# EasyEDA schematic 1-Schematic_polaris_3.3 copy.json

## Sheets
1 S_3.3_1.2 copy: TITLE: TESTING BY ACUI; REV: 3.3; Date: 2021-12-22; Sheet: 1/2; Drawn By: Syahmi Fouzi; Company: Hermit Solutions
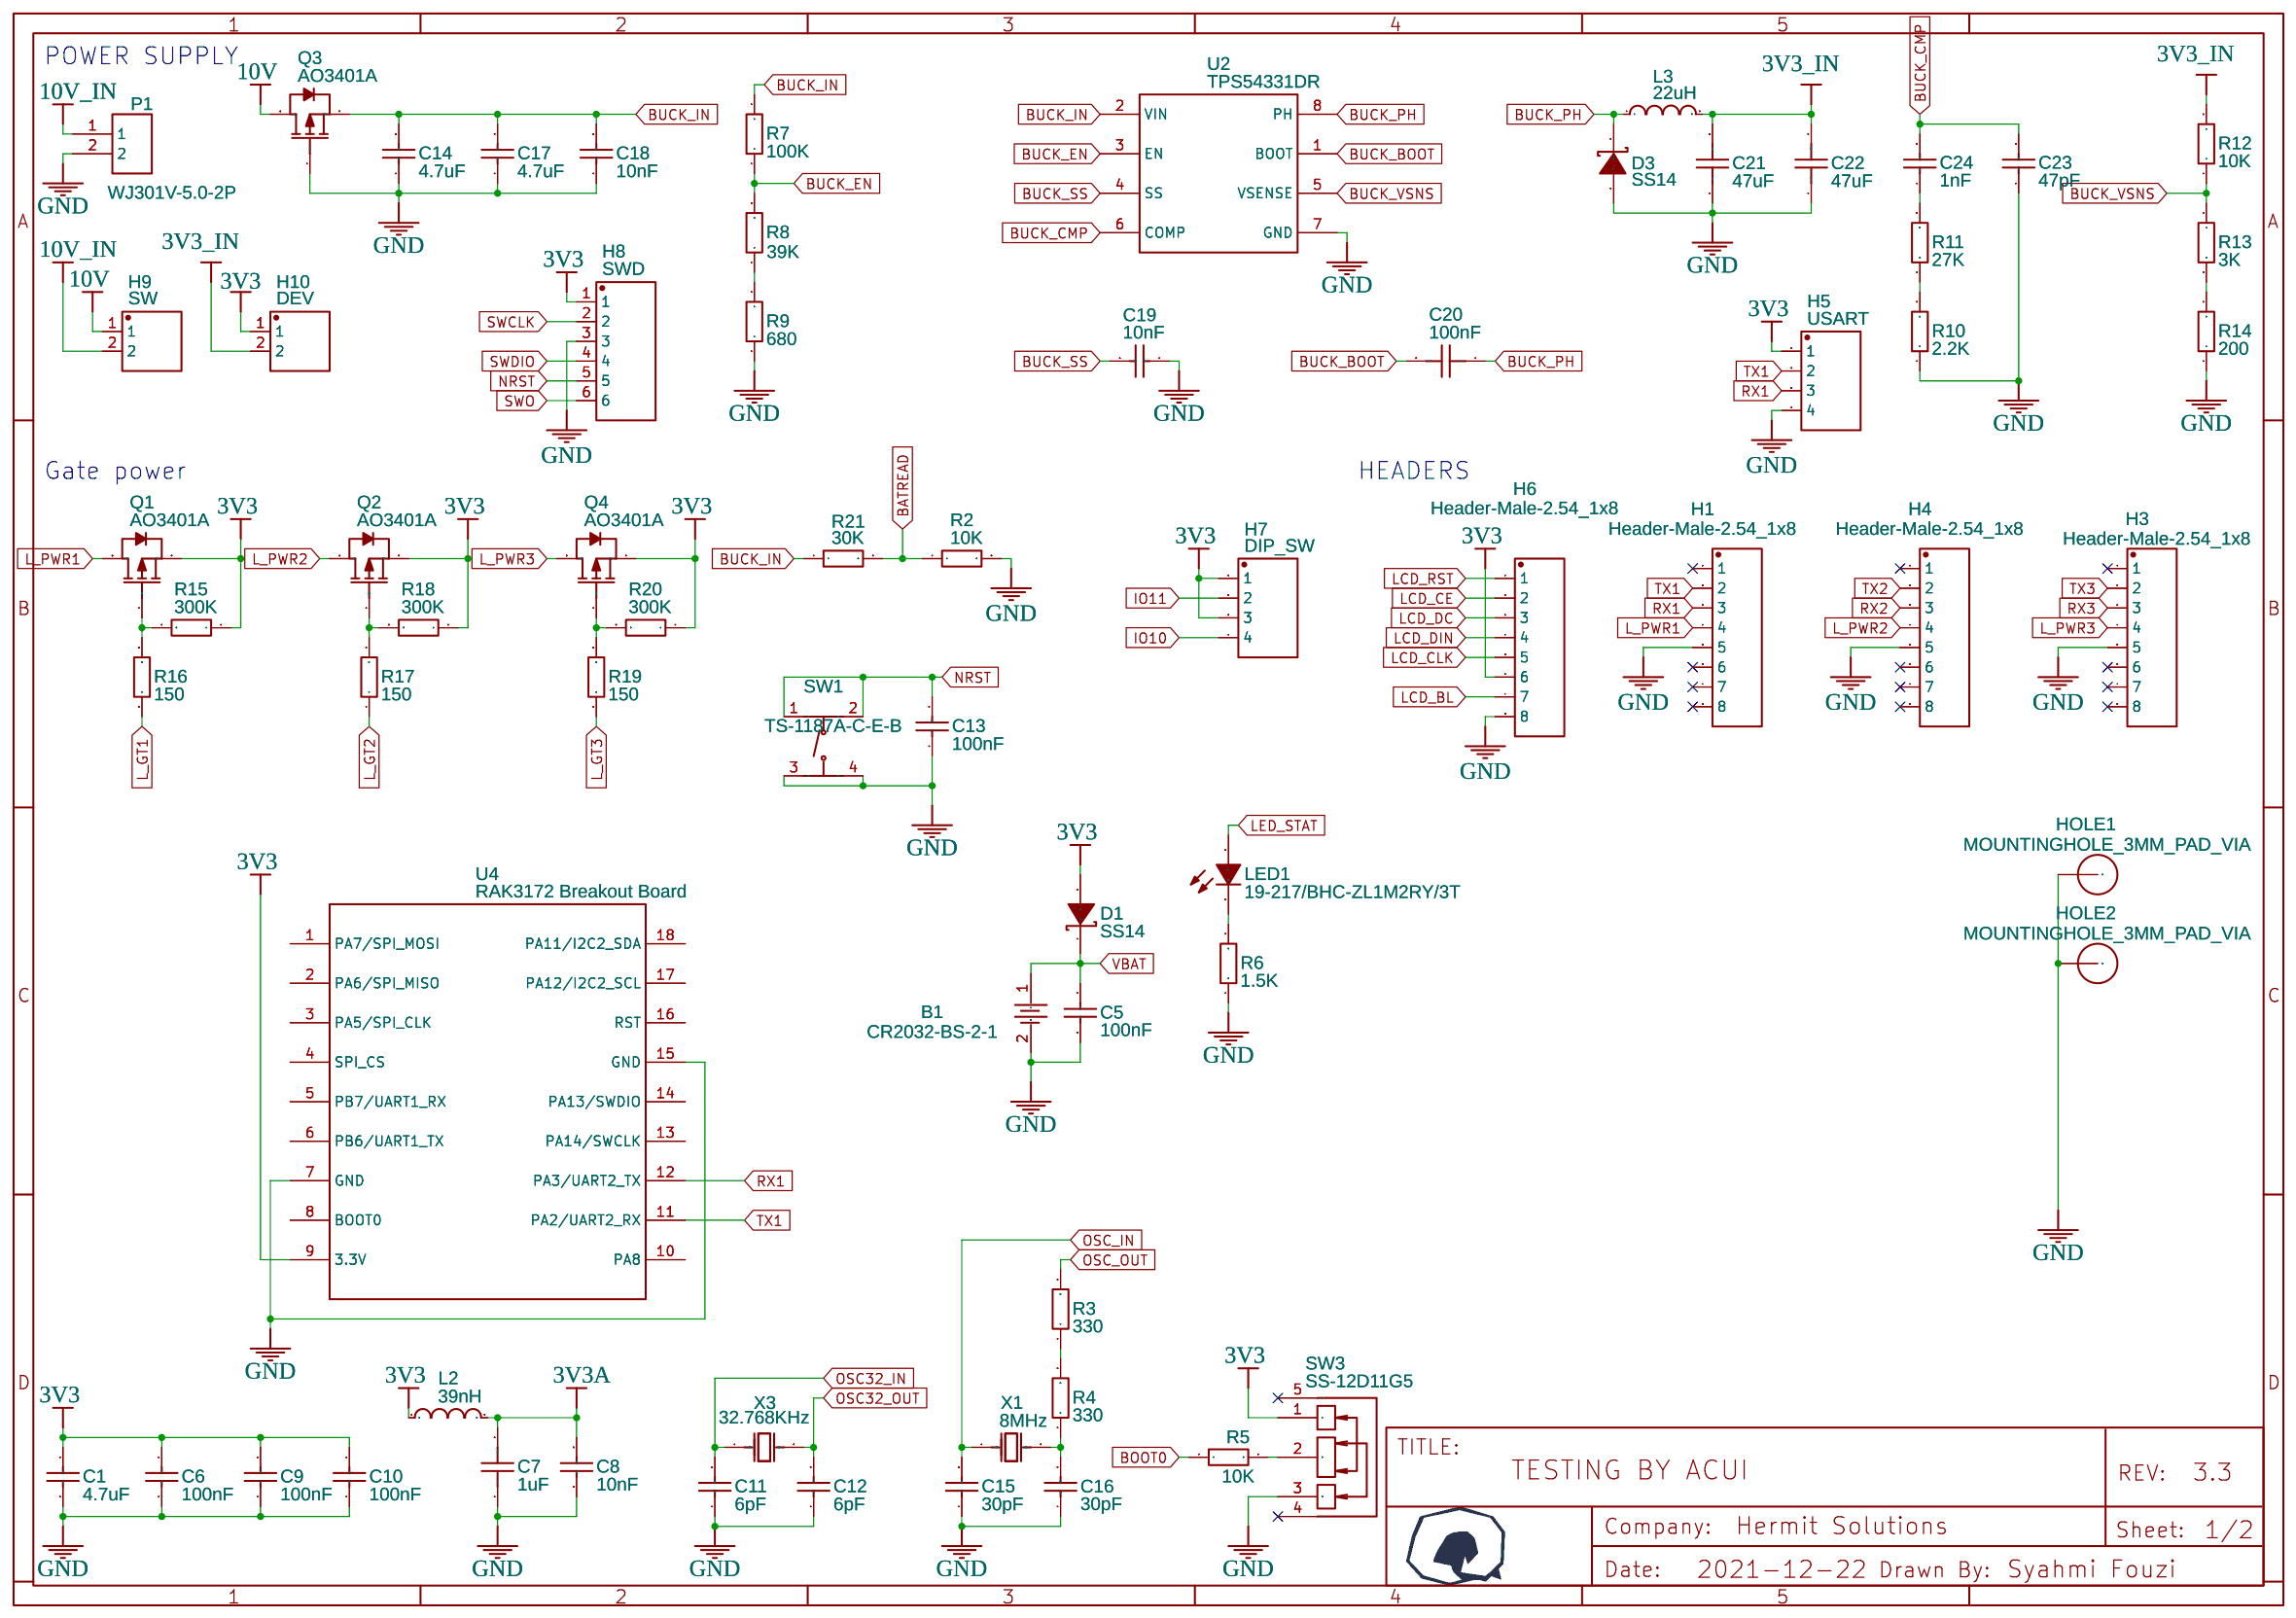
[diagram p0: S_3.3_1.2 copy]
2 S_3.3_2.2 copy: TITLE: POLAR
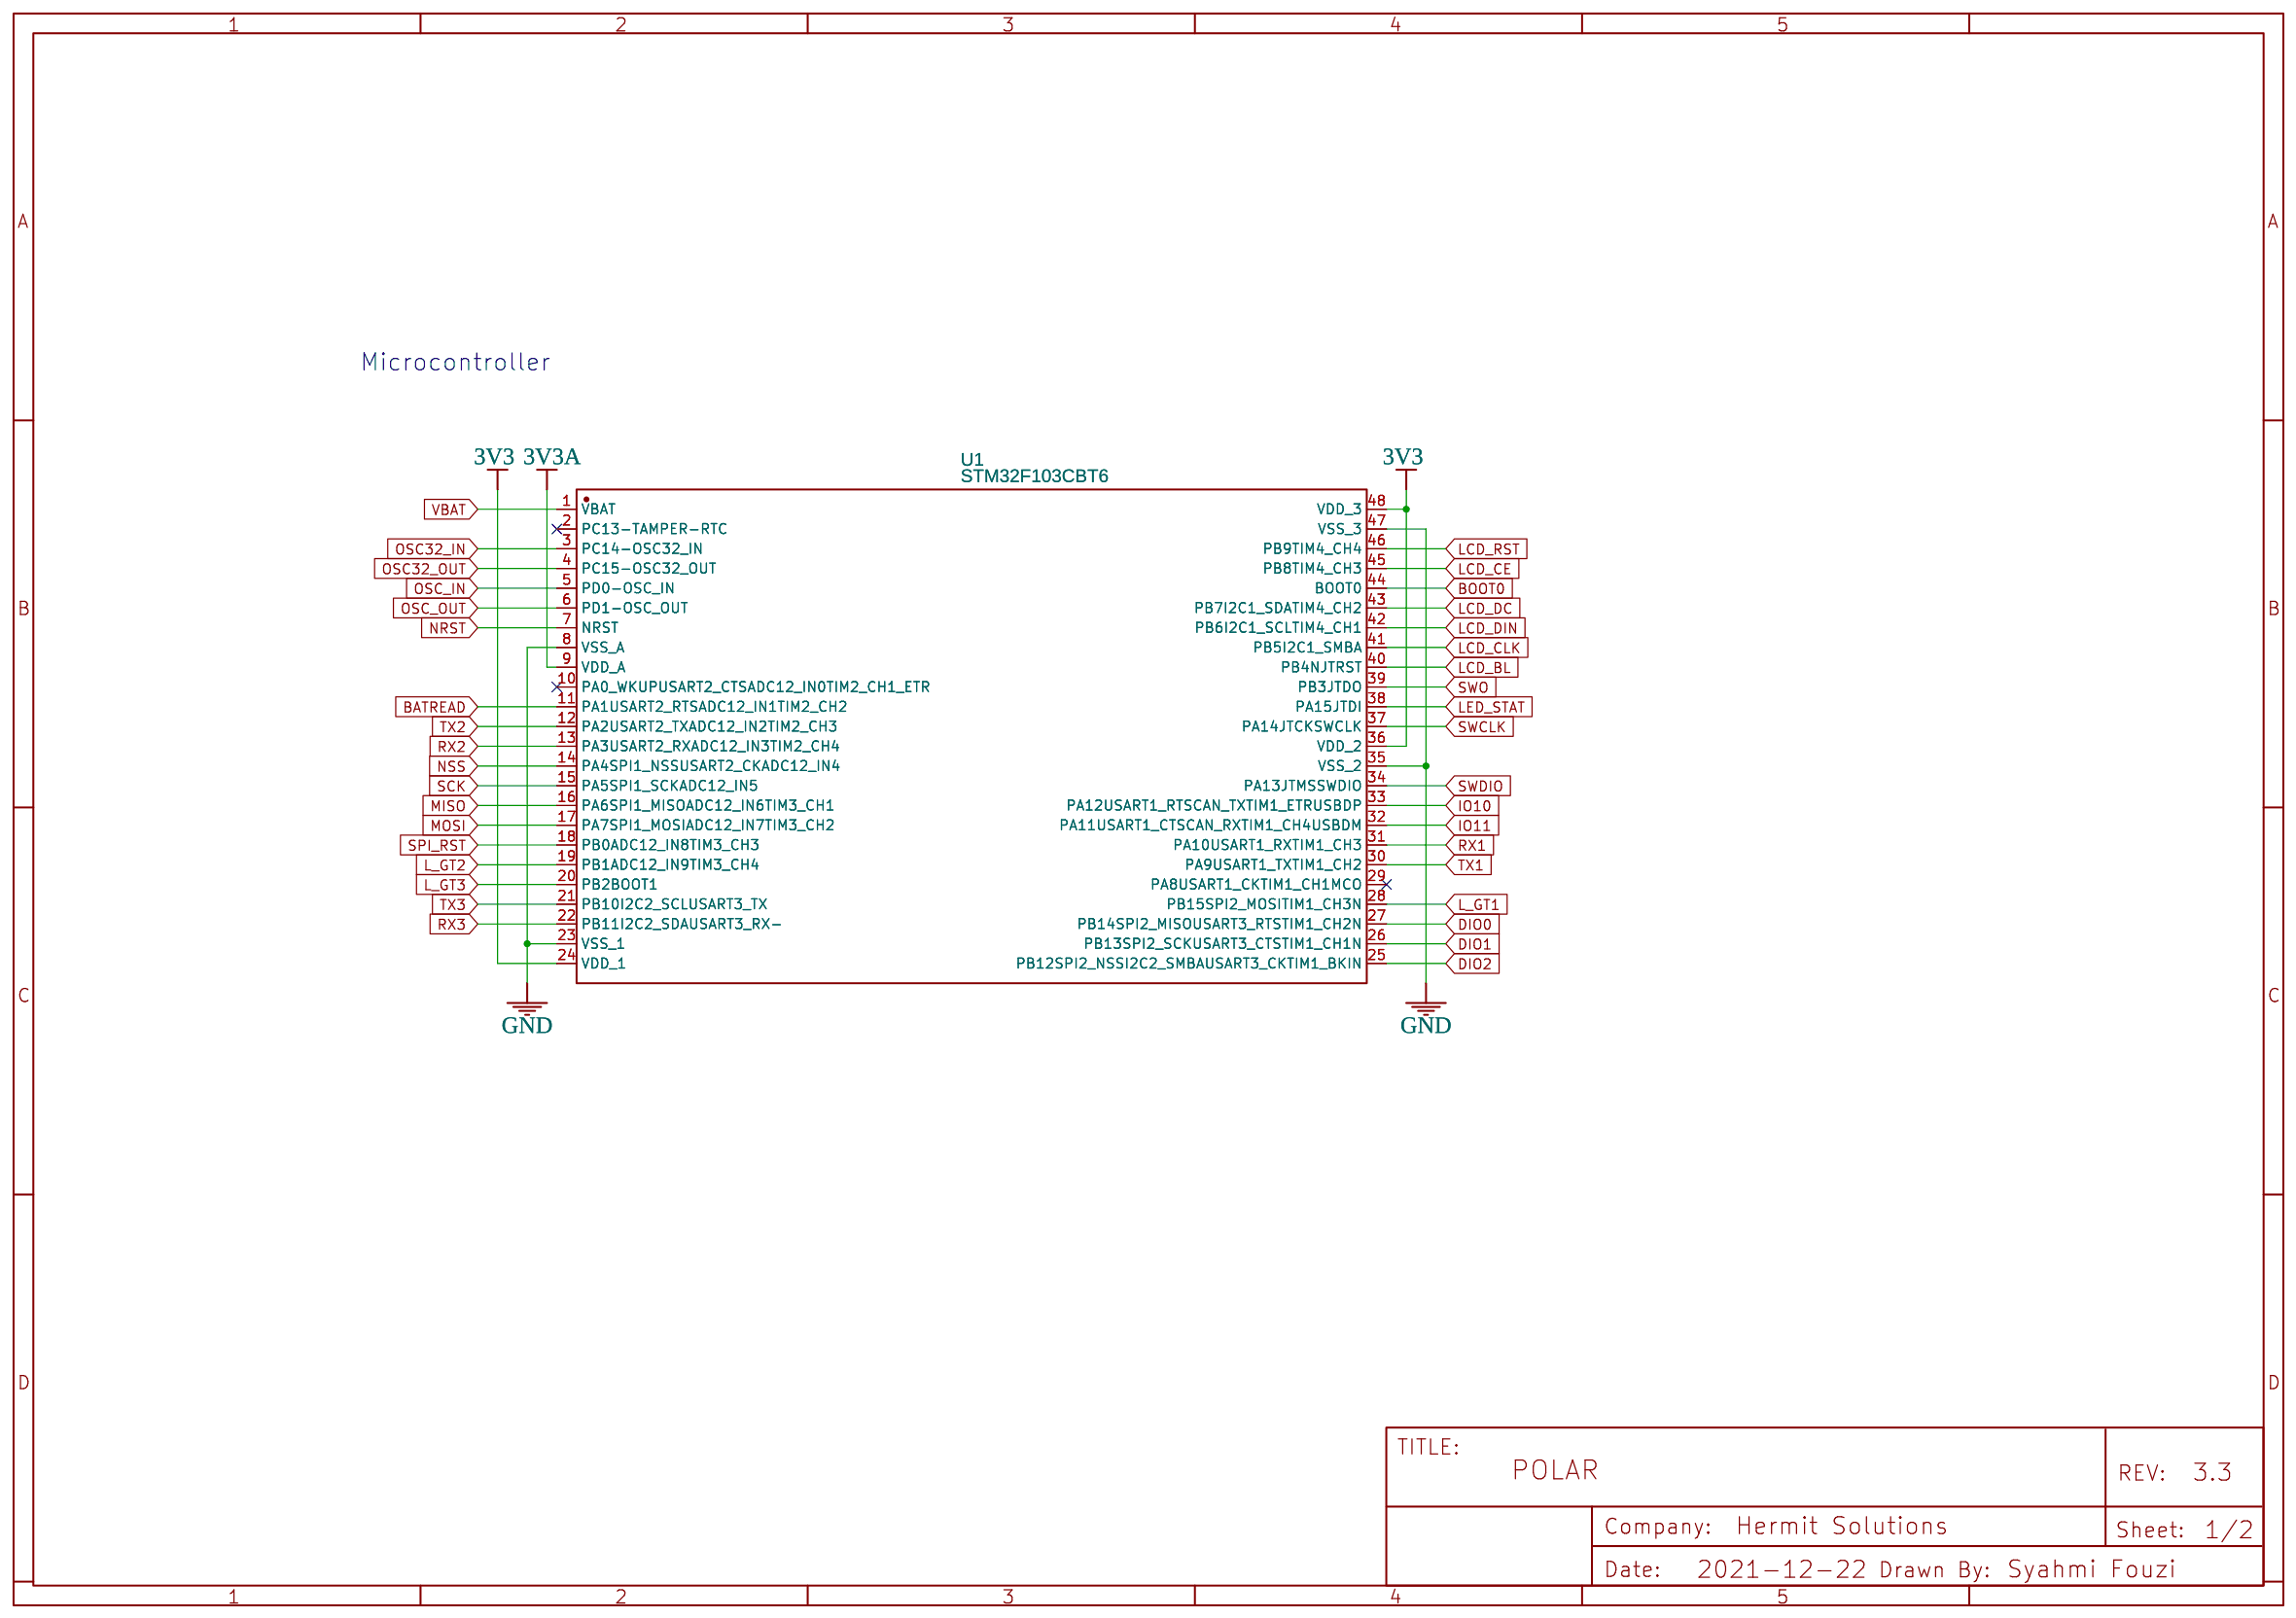
[diagram p1: S_3.3_2.2 copy]

## Parts
sheet S_3.3_1.2 copy
B1  CR2032-BS-2-1  [BAT-TH_BS-2-1]
C1  4.7uF  [C0603]
C5  100nF  [C0805]
C6  100nF  [C0402_NEW]
C7  1uF  [C0402]
C8  10nF  [C0402]
C9  100nF  [C0402_NEW]
C10  100nF  [C0402_NEW]
C11  6pF  [C0402]
C12  6pF  [C0402]
C13  100nF  [C0402_NEW]
C14  4.7uF  [C1206]
C15  30pF  [C0402]
C16  30pF  [C0402]
C17  4.7uF  [C1206]
C18  10nF  [C0603]
C19  10nF  [C0603]
C20  100nF  [C0603]
C21  47uF  [C1206]
C22  47uF  [C1206]
C23  47pF  [C0603]
C24  1nF  [C0603]
D1  SS14  [SMA_L4.4-W2.8-LS5.4-RD]
D3  SS14  [SMA_L4.4-W2.8-LS5.4-RD]
H1  Header-Male-2.54_1x8  [HDR-TH_8P-P2.54-V-M]
H3  Header-Male-2.54_1x8  [HDR-TH_8P-P2.54-V-M]
H4  Header-Male-2.54_1x8  [HDR-TH_8P-P2.54-V-M]
H5  USART  [HDR-TH_4P-P2.54-V]
H6  Header-Male-2.54_1x8  [HDR-TH_8P-P2.54-V-M]
H7  DIP_SW  [HDR-TH_4P-P2.54-V]
H8  SWD  [HDR-TH_6P-P2.54-V_Z-211-0611-0021-001]
H9  SW  [HDR-TH_2P-P2.54-V-M-1]
H10  DEV  [HDR-TH_2P-P2.54-V-M-1]
HOLE1  MOUNTINGHOLE_3MM_PAD_VIA  [MOUNTINGHOLE_3MM_PAD_VIA]
HOLE2  MOUNTINGHOLE_3MM_PAD_VIA  [MOUNTINGHOLE_3MM_PAD_VIA]
L2  39nH  [L0402]
L3  22uH  [IND-SMD_L11.5-W10.0_FXL1040]
LED1  19-217/BHC-ZL1M2RY/3T  [LED0603-R-RD]
P1  WJ301V-5.0-2P  [CONN-TH_2P-P5.00_WJ301V-5.00-2P]
Q1  AO3401A  [SOT-23_L2.9-W1.3-P1.90-LS2.4-BR]
Q2  AO3401A  [SOT-23_L2.9-W1.3-P1.90-LS2.4-BR]
Q3  AO3401A  [SOT-23_L2.9-W1.3-P1.90-LS2.4-BR]
Q4  AO3401A  [SOT-23_L2.9-W1.3-P1.90-LS2.4-BR]
R2  10K  [R0805]
R3  330  [R0402]
R4  330  [R0402]
R5  10K  [R0402]
R6  1.5K  [R0603]
R7  100K  [R0603]
R8  39K  [R0603]
R9  680  [R0603]
R10  2.2K  [R0603]
R11  27K  [R0603]
R12  10K  [R0603]
R13  3K  [R0603]
R14  200  [R0603]
R15  300K  [R0402]
R16  150  [R0402]
R17  150  [R0402]
R18  300K  [R0402]
R19  150  [R0402]
R20  300K  [R0402]
R21  30K  [R0805]
SW1  TS-1187A-C-E-B  [SW-SMD_4P-L5.1-W5.1-P3.70-LS6.5-TL-2]
SW3  SS-12D11G5  [SW-TH_SS-12D11G5]
U2  TPS54331DR  [SOIC-8_L5.0-W4.0-P1.27-LS6.0-BL]
U4  RAK3172 Breakout Board  [RAK3172 BREAKOUT BOARD]
X1  8MHz  [OSC-SMD_L5.0-W3.2]
X3  32.768KHz  [FC-12M_L2.0-W1.2]
sheet S_3.3_2.2 copy
U1  STM32F103CBT6  [LQFP-48_L7.0-W7.0-P0.50-LS9.0-BL]

## Library data of the parts
B1 = CR2032-BS-2-1: Supplier: LCSC; Manufacturer: Q&J; Manufacturer Part: BS-2-1; image: //image.lceda.cn/szlcsc/C70376.jpg; Supplier Part: C70376
C1 = CL10A475KO8NNNC: Supplier: LCSC; Manufacturer: SAMSUNG; Supplier Part: C19666; JLCPCB Part Class: Basic Part
C5 = CC0805KRX7R9BB104: Supplier: LCSC; Manufacturer: YAGEO; Supplier Part: C49678; SMT Type: Basic; JLCPCB SMD: Yes; LCSC Assembly: Yes; Assembly Type: smtWeld; Paste Type: base
C6 C9 C10 C13 = CL05B104KO5NNNC: Supplier: LCSC; Manufacturer: SAMSUNG; Supplier Part: C1525; JLCPCB Part Class: Basic Part
C7 = CL05A105KA5NQNC: Supplier: LCSC; Manufacturer: SAMSUNG; Supplier Part: C52923; JLCPCB Part Class: Basic Part
C8 = CL05B103KB5NNNC: Supplier: LCSC; Manufacturer: SAMSUNG; Supplier Part: C15195; JLCPCB Part Class: Basic Part
C11 C12 = 0402CG6R0C500NT_C30274: Supplier: LCSC; Manufacturer: FH; Manufacturer Part: 0402CG6R0C500NT; Supplier Part: C30274; JLCPCB Part Class: Basic Part
C14 C17 = 1206B475K500NT: Supplier: LCSC; Manufacturer: FH; Supplier Part: C29823; JLCPCB Part Class: Basic Part
C15 C16 = 0402CG300J500NT: Supplier: LCSC; Manufacturer: FH; Supplier Part: C1570; JLCPCB Part Class: Basic Part
C18 C19 = 0603B103K500NT: Supplier: LCSC; Manufacturer: FH; Supplier Part: C57112; JLCPCB Part Class: Basic Part
C20 = CC0603KRX7R9BB104: Supplier: LCSC; Manufacturer: YAGEO; Supplier Part: C14663; JLCPCB Part Class: Basic Part
C21 C22 = CL31A476MPHNNNE: Supplier: LCSC; Manufacturer: SAMSUNG; Supplier Part: C96123; JLCPCB Part Class: Basic Part
C23 = CL10C470JB8NNNC: Supplier: LCSC; Manufacturer: SAMSUNG; Supplier Part: C1671; JLCPCB Part Class: Basic Part
C24 = CL10B102KB8NNNC: Supplier: LCSC; Manufacturer: SAMSUNG; Supplier Part: C1588; JLCPCB Part Class: Basic Part
D1 D3 = SS14: Supplier: LCSC; Manufacturer: MDD; Supplier Part: C2480; JLCPCB Part Class: Basic Part
H1 H3 H4 H6 = Header-Male-2.54_1x8: Supplier: LCSC; Manufacturer: Ckmtw; Manufacturer Part: 210S-1*8P L=11.6MMGold-plated black; Contributor: LCSC; Supplier Part: C124381; LCSC Assembly: Yes; SMT Type: Extend
H5 = Header-Male-2.54_1x4: Supplier: LCSC; Manufacturer: Ckmtw; Manufacturer Part: 210S-1*4P L=11.6MMGold-plated black; Contributor: LCSC; Supplier Part: C124378; JLCPCB Part Class: Extended Part
H7 = Header-Male-2.54_1x4: Supplier: LCSC; Manufacturer: Ckmtw; Manufacturer Part: 210S-1*4P L=11.6MMGold-plated black; Contributor: LCSC; Supplier Part: C124378; LCSC Assembly: Yes; SMT Type: Extend; Assembly Type: manualWeld; Paste Type: expand
H8 = 210S-1*6P L=11.6MMGold-plated black: Supplier: LCSC; Manufacturer: Ckmtw; Contributor: LCSC; Supplier Part: C124380; JLCPCB Part Class: Extended Part
H9 H10 = 210S-1*2P L=11.6MMGold-plated black: Supplier: LCSC; Manufacturer: Ckmtw; Contributor: LCSC; Supplier Part: C124375; JLCPCB Part Class: Extended Part
HOLE1 HOLE2 = MOUNTINGHOLE_3MM_PAD_VIA: Contributor: Janissary03
L2 = SDCL1005C39NJTDF: Supplier: LCSC; Manufacturer: Sunlord; Supplier Part: C26443; JLCPCB Part Class: Basic Part
L3 = MWSA1004S-220MT: Supplier: LCSC; Supplier Part: C408489; Manufacturer: Sunlord; Contributor: LCSC
LED1 = 19-217/BHC-ZL1M2RY/3T: Supplier: LCSC; Manufacturer: EVERLIGHT; Supplier Part: C72041; JLCPCB Part Class: Basic Part
P1 = WJ301V-5.0-2P: Supplier: LCSC; Manufacturer: ReliaPro; Supplier Part: C8475; JLCPCB Part Class: Extended Part
Q1-Q4 = AO3401A: Supplier: LCSC; Manufacturer: AOS; Supplier Part: C15127; JLCPCB Part Class: Basic Part
R2 = 0805W8F1002T5E: Supplier: LCSC; Manufacturer: UniOhm; Supplier Part: C17414; SMT Type: Basic; JLCPCB SMD: Yes; LCSC Assembly: Yes; Assembly Type: smtWeld; Paste Type: base
R3 R4 = 0402WGF3300TCE: Supplier: LCSC; Manufacturer: UniOhm; Supplier Part: C25104; JLCPCB Part Class: Basic Part
R5 = 0402WGF1002TCE: Supplier: LCSC; Manufacturer: UniOhm; Supplier Part: C25744; JLCPCB Part Class: Basic Part
R6 = 0603WAF1501T5E: Supplier: LCSC; Manufacturer: UniOhm; Supplier Part: C22843; JLCPCB Part Class: Basic Part
R7 = 0603WAF1003T5E: Supplier: LCSC; Manufacturer: UniOhm; Supplier Part: C25803; JLCPCB Part Class: Basic Part
R8 = 0603WAF3902T5E: Supplier: LCSC; Manufacturer: UniOhm; Supplier Part: C23153; JLCPCB Part Class: Basic Part
R9 = 0603WAF6800T5E: Supplier: LCSC; Manufacturer: UniOhm; Supplier Part: C23228; JLCPCB Part Class: Basic Part
R10 = 0603WAF2201T5E: Supplier: LCSC; Manufacturer: UniOhm; Supplier Part: C4190; JLCPCB Part Class: Basic Part
R11 = 0603WAF2702T5E: Supplier: LCSC; Manufacturer: UniOhm; Supplier Part: C22967; JLCPCB Part Class: Basic Part
R12 = 0603WAF1002T5E: Supplier: LCSC; Manufacturer: UniOhm; Supplier Part: C25804; JLCPCB Part Class: Basic Part
R13 = 0603WAF3001T5E: Supplier: LCSC; Manufacturer: UniOhm; Supplier Part: C4211; JLCPCB Part Class: Basic Part
R14 = 0603WAF2000T5E: Supplier: LCSC; Manufacturer: UniOhm; Supplier Part: C8218; JLCPCB Part Class: Basic Part
R15 R18 R20 = 0402WGF3003TCE: Supplier: LCSC; Manufacturer: UniOhm; Supplier Part: C25774; JLCPCB Part Class: Basic Part
R16 R17 R19 = 0402WGF1500TCE: Supplier: LCSC; Manufacturer: UniOhm; Supplier Part: C25082; JLCPCB Part Class: Basic Part
R21 = 0805W8F3002T5E: Supplier: LCSC; Manufacturer: UniOhm; Supplier Part: C17621; JLCPCB Part Class: Basic Part
SW1 = TS-1187A-C-E-B: Supplier: LCSC; Supplier Part: C318887; Manufacturer: XKB Enterprise; Contributor: LCSC; Paste Type: Extended Part; JLCPCB Part Class: Extended Part
SW3 = SS-12D11G5: Supplier: LCSC; Supplier Part: C692484; Manufacturer: XKB Connectivity; Contributor: LCSC; JLCPCB Part Class: Extended Part
U2 = TPS54331DR: Supplier: LCSC; Manufacturer: TI; Supplier Part: C9865; JLCPCB Part Class: Basic Part
U4 = RAK3172 Breakout Board: Manufacturer: RakWireless; Manufacturer Part: 316025; Supplier Part: RAK3272S; link: https://store.rakwireless.com/products/wisduo-breakout-board-rak3272s; Contributor: burduli
X1 = X50328MSB2GI: Supplier: LCSC; Manufacturer: YXC; Supplier Part: C115962; JLCPCB Part Class: Basic Part
X3 = FC-12M32.768KHZ7PF20PPM: Supplier: LCSC; Manufacturer: EPSON; Supplier Part: C99009; JLCPCB Part Class: Extended Part
U1 = STM32F103CBT6: Supplier: LCSC; Manufacturer: STMicroelectronics; Supplier Part: C8304; JLCPCB Part Class: Extended Part

## Nets
3V3: C1.2 C6.2 C9.2 C10.2 D1.2(A) H5.1 H6.6 H7.1 H7.3 H8.1 H10.1 L2.1 Q1.2(S) Q2.2(S) Q4.2(S) R15.1 R18.1 R20.1 SW3.1 U1.24(VDD_1) U1.36(VDD_2) U1.48(VDD_3) U4.9(3.3V)
3V3_IN: C21.2 C22.2 H10.2 L3.2 R12.2
3V3A: C7.2 C8.2 L2.2 U1.9(VDD_A)
10V: H9.1 Q3.3(D)
10V_IN: H9.2 P1.1
GND: B1.2 C1.1 C5.1 C6.1 C7.1 C8.1 C9.1 C10.1 C11.1 C12.1 C13.1 C14.1 C15.1 C16.1 C17.1 C18.1 C19.1 C21.1 C22.1 C23.1 D3.2(A) H1.5 H3.5 H4.5 H5.4 H6.8 H8.3 HOLE1.1 HOLE2.1 P1.2 Q3.1(G) R2.2 R6.1 R9.1 R10.1 R14.1 SW1.3(C) SW1.4(D) SW3.3 U1.8(VSS_A) U1.23(VSS_1) U1.35(VSS_2) U1.47(VSS_3) U2.7(GND) U4.7(GND) U4.15(GND)
VBAT: B1.1 C5.2 D1.1(K) U1.1(VBAT)
BATREAD: R2.1 R21.2 U1.11(PA1USART2_RTSADC12_IN1TIM2_CH2)
BOOT0: R5.1 U1.44(BOOT0)
BUCK_BOOT: C20.2 U2.1(BOOT)
BUCK_CMP: C23.2 C24.2 U2.6(COMP)
BUCK_EN: R7.1 R8.2 U2.3(EN)
BUCK_IN: C14.2 C17.2 C18.2 Q3.2(S) R7.2 R21.1 U2.2(VIN)
BUCK_PH: C20.1 D3.1(K) L3.1 U2.8(PH)
BUCK_SS: C19.2 U2.4(SS)
BUCK_VSNS: R12.1 R13.1 U2.5(VSENSE)
DIO0: U1.27(PB14SPI2_MISOUSART3_RTSTIM1_CH2N)
DIO1: U1.26(PB13SPI2_SCKUSART3_CTSTIM1_CH1N)
DIO2: U1.25(PB12SPI2_NSSI2C2_SMBAUSART3_CKTIM1_BKIN)
IO10: H7.4 U1.33(PA12USART1_RTSCAN_TXTIM1_ETRUSBDP)
IO11: H7.2 U1.32(PA11USART1_CTSCAN_RXTIM1_CH4USBDM)
L_GT1: R16.1 U1.28(PB15SPI2_MOSITIM1_CH3N)
L_GT2: R17.1 U1.19(PB1ADC12_IN9TIM3_CH4)
L_GT3: R19.1 U1.20(PB2BOOT1)
L_PWR1: H1.4 Q1.3(D)
L_PWR2: H4.4 Q2.3(D)
L_PWR3: H3.4 Q4.3(D)
LCD_BL: H6.7 U1.40(PB4NJTRST)
LCD_CE: H6.2 U1.45(PB8TIM4_CH3)
LCD_CLK: H6.5 U1.41(PB5I2C1_SMBA)
LCD_DC: H6.3 U1.43(PB7I2C1_SDATIM4_CH2)
LCD_DIN: H6.4 U1.42(PB6I2C1_SCLTIM4_CH1)
LCD_RST: H6.1 U1.46(PB9TIM4_CH4)
LED_STAT: LED1.1(A) U1.38(PA15JTDI)
MISO: U1.16(PA6SPI1_MISOADC12_IN6TIM3_CH1)
MOSI: U1.17(PA7SPI1_MOSIADC12_IN7TIM3_CH2)
NRST: C13.2 H8.5 SW1.1(A) SW1.2(B) U1.7(NRST)
NSS: U1.14(PA4SPI1_NSSUSART2_CKADC12_IN4)
OSC32_IN: C11.2 U1.3(PC14-OSC32_IN) X3.1(OSC1)
OSC32_OUT: C12.2 U1.4(PC15-OSC32_OUT) X3.2(OSC2)
OSC_IN: C15.2 U1.5(PD0-OSC_IN) X1.1(OSC1)
OSC_OUT: R3.2 U1.6(PD1-OSC_OUT)
RX1: H1.3 H5.3 U1.31(PA10USART1_RXTIM1_CH3) U4.12(PA3/UART2_TX)
RX2: H4.3 U1.13(PA3USART2_RXADC12_IN3TIM2_CH4)
RX3: H3.3 U1.22(PB11I2C2_SDAUSART3_RX-)
SCK: U1.15(PA5SPI1_SCKADC12_IN5)
SPI_RST: U1.18(PB0ADC12_IN8TIM3_CH3)
SWCLK: H8.2 U1.37(PA14JTCKSWCLK)
SWDIO: H8.4 U1.34(PA13JTMSSWDIO)
SWO: H8.6 U1.39(PB3JTDO)
TX1: H1.2 H5.2 U1.30(PA9USART1_TXTIM1_CH2) U4.11(PA2/UART2_RX)
TX2: H4.2 U1.12(PA2USART2_TXADC12_IN2TIM2_CH3)
TX3: H3.2 U1.21(PB10I2C2_SCLUSART3_TX)
Net-(C16-2): C16.2 R4.1 X1.2(OSC2)
Net-(C24-1): C24.1 R11.2
Net-(LED1-2): LED1.2(C) R6.2
Net-(Q1-1): Q1.1(G) R15.2 R16.2
Net-(Q2-1): Q2.1(G) R17.2 R18.2
Net-(Q4-1): Q4.1(G) R19.2 R20.2
Net-(R3-1): R3.1 R4.2
Net-(R5-2): R5.2 SW3.2
Net-(R8-1): R8.1 R9.2
Net-(R10-2): R10.2 R11.1
Net-(R13-2): R13.2 R14.2

Not connected (* = marked no-connect by the designer): H1 1* 6* 7* 8*; H3 1* 6* 7* 8*; H4 1* 6* 7* 8*; SW3 4* 5*; U1 2(PC13-TAMPER-RTC)* 10(PA0_WKUPUSART2_CTSADC12_IN0TIM2_CH1_ETR)* 29(PA8USART1_CKTIM1_CH1MCO)*; U4 1(PA7/SPI_MOSI) 2(PA6/SPI_MISO) 3(PA5/SPI_CLK) 4(SPI_CS) 5(PB7/UART1_RX) 6(PB6/UART1_TX) 8(BOOT0) 10(PA8) 13(PA14/SWCLK) 14(PA13/SWDIO) 16(RST) 17(PA12/I2C2_SCL) 18(PA11/I2C2_SDA)

## Notes on the sheets
sheet 1
- POWER SUPPLY
- Gate power
- HEADERS
sheet 2
- Microcontroller
